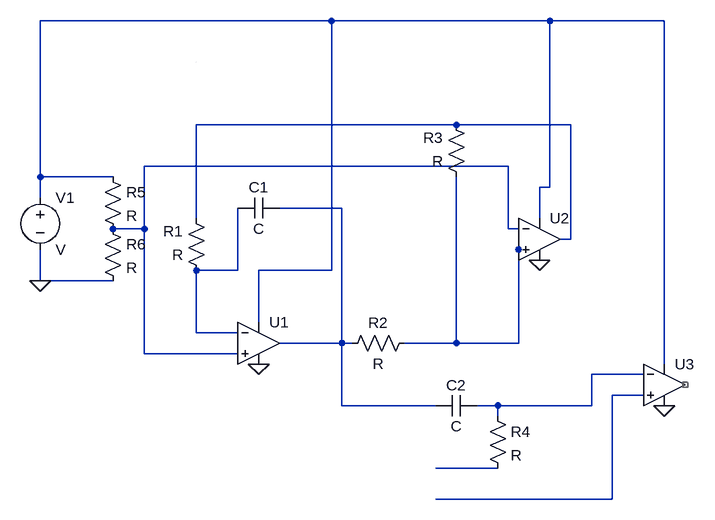
[diagram p0: schematic Draft1.asc]
Draft1.asc, the LTspice schematic file:
Version 4
SHEET 1 1096 880
WIRE 208 -64 -240 -64
WIRE 544 -64 208 -64
WIRE 720 -64 544 -64
WIRE 400 96 0 96
WIRE 576 96 400 96
WIRE 480 160 -80 160
WIRE -240 176 -240 -64
WIRE -128 176 -240 176
WIRE 544 192 544 -64
WIRE 544 192 528 192
WIRE -240 208 -240 176
WIRE 224 224 128 224
WIRE 0 240 0 96
WIRE 528 240 528 192
WIRE -80 256 -80 160
WIRE -80 256 -128 256
WIRE 480 256 480 160
WIRE 496 256 480 256
WIRE 576 272 576 96
WIRE 576 272 560 272
WIRE 496 288 496 272
WIRE 64 320 64 224
WIRE 64 320 0 320
WIRE 208 320 208 -64
WIRE 208 320 96 320
WIRE -240 336 -240 288
WIRE -128 336 -240 336
WIRE 96 400 96 320
WIRE 0 416 0 320
WIRE 64 416 0 416
WIRE 224 432 224 224
WIRE 224 432 128 432
WIRE 240 432 224 432
WIRE 400 432 400 176
WIRE 400 432 320 432
WIRE 496 432 496 288
WIRE 496 432 400 432
WIRE -80 448 -80 256
WIRE 64 448 -80 448
WIRE 720 464 720 -64
WIRE 688 480 608 480
WIRE 688 512 640 512
WIRE 224 528 224 432
WIRE 368 528 224 528
WIRE 464 528 432 528
WIRE 608 528 608 480
WIRE 608 528 464 528
WIRE 464 544 464 528
WIRE 464 624 368 624
WIRE 640 672 640 512
WIRE 640 672 368 672
WIRE 0 0 0 0
FLAG 96 464 0
FLAG -240 336 0
FLAG 528 304 0
FLAG 720 528 0
SYMBOL Opamps\\UniversalOpamp2 96 432 R0
SYMATTR InstName U1
SYMBOL cap 128 208 R90
WINDOW 0 0 32 VBottom 2
WINDOW 3 32 32 VTop 2
SYMATTR InstName C1
SYMBOL res 16 336 R180
WINDOW 0 36 76 Left 2
WINDOW 3 36 40 Left 2
SYMATTR InstName R1
SYMBOL voltage -240 192 R0
SYMATTR InstName V1
SYMBOL res 336 416 R90
WINDOW 0 0 56 VBottom 2
WINDOW 3 32 56 VTop 2
SYMATTR InstName R2
SYMBOL res 416 192 R180
WINDOW 0 36 76 Left 2
WINDOW 3 36 40 Left 2
SYMATTR InstName R3
SYMBOL cap 432 512 R90
WINDOW 0 0 32 VBottom 2
WINDOW 3 32 32 VTop 2
SYMATTR InstName C2
SYMBOL res 448 528 R0
SYMATTR InstName R4
SYMBOL Opamps\\UniversalOpamp2 528 272 R0
SYMATTR InstName U2
SYMBOL Opamps\\UniversalOpamp2 720 496 R0
SYMATTR InstName U3
SYMBOL res -144 160 R0
SYMATTR InstName R5
SYMBOL res -144 240 R0
SYMATTR InstName R6

The netlist it stands for:
* Draft1.asc
XU1 N003 N006 N001 0 N004 level.2 Avol=1Meg GBW=10Meg Slew=10Meg ilimit=25m rail=0 Vos=0 phimargin=45 en=0 enk=0 in=0 ink=0 Rin=500Meg  ; pins IN+ IN- V+ V- OUT
C1 N004 N006 C
R1 N006 N002 R
V1 N001 0 V
R2 N005 N004 R
R3 N005 N002 R
C2 N007 N004 C
R4 N007 N009 R
XU2 N005 N003 N001 0 N002 level.2 Avol=1Meg GBW=10Meg Slew=10Meg ilimit=25m rail=0 Vos=0 phimargin=45 en=0 enk=0 in=0 ink=0 Rin=500Meg  ; pins IN+ IN- V+ V- OUT
XU3 N008 N007 N001 0 NC_01 level.2 Avol=1Meg GBW=10Meg Slew=10Meg ilimit=25m rail=0 Vos=0 phimargin=45 en=0 enk=0 in=0 ink=0 Rin=500Meg  ; pins IN+ IN- V+ V- OUT
R5 N001 N003 R
R6 N003 0 R
.lib UniversalOpamps2.sub
.backanno
.end